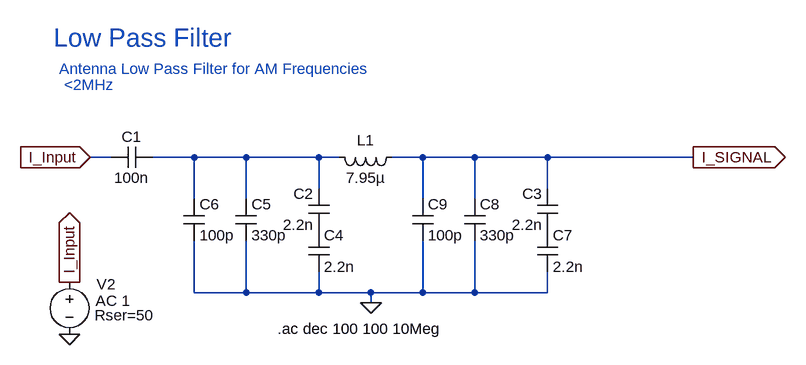
[diagram p0: schematic LP_filter.asc]
LP_filter.asc, the LTspice schematic file:
Version 4.1
SHEET 1 1076 680
WIRE -336 128 -368 128
WIRE -208 128 -272 128
WIRE -128 128 -208 128
WIRE -16 128 -128 128
WIRE 16 128 -16 128
WIRE 144 128 96 128
WIRE 224 128 144 128
WIRE 336 128 224 128
WIRE 560 128 336 128
WIRE -16 176 -16 128
WIRE 336 176 336 128
WIRE -208 192 -208 128
WIRE -128 192 -128 128
WIRE 144 192 144 128
WIRE 224 192 224 128
WIRE -208 336 -208 256
WIRE -128 336 -128 256
WIRE -128 336 -208 336
WIRE -16 336 -16 304
WIRE -16 336 -128 336
WIRE 64 336 -16 336
WIRE 144 336 144 256
WIRE 144 336 64 336
WIRE 224 336 224 256
WIRE 224 336 144 336
WIRE 336 336 336 304
WIRE 336 336 224 336
WIRE 64 352 64 336
FLAG -400 400 0
FLAG -400 320 I_Input
IOPIN -400 320 Out
FLAG -368 128 I_Input
IOPIN -368 128 In
FLAG 560 128 I_SIGNAL
IOPIN 560 128 Out
FLAG 64 352 0
SYMBOL voltage -400 304 R0
WINDOW 123 40 45 Left 2
WINDOW 39 39 67 Left 2
WINDOW 0 42 19 Left 2
SYMATTR Value2 AC 1
SYMATTR SpiceLine Rser=50
SYMATTR InstName V2
SYMATTR Value ""
SYMBOL cap -272 112 R90
WINDOW 0 0 32 VBottom 2
WINDOW 3 32 32 VTop 2
SYMATTR InstName C1
SYMATTR Value 100n
SYMBOL cap 0 240 R180
WINDOW 0 24 56 Left 2
WINDOW 3 24 8 Left 2
SYMATTR InstName C2
SYMATTR Value 2.2n
SYMBOL ind 112 112 R90
WINDOW 0 5 56 VBottom 2
WINDOW 3 32 56 VTop 2
SYMATTR InstName L1
SYMATTR Value 7.95µ
SYMBOL cap -32 240 R0
SYMATTR InstName C4
SYMATTR Value 2.2n
SYMBOL cap -144 192 R0
SYMATTR InstName C5
SYMATTR Value 330p
SYMBOL cap -224 192 R0
SYMATTR InstName C6
SYMATTR Value 100p
SYMBOL cap 352 240 R180
WINDOW 0 24 56 Left 2
WINDOW 3 24 8 Left 2
SYMATTR InstName C3
SYMATTR Value 2.2n
SYMBOL cap 320 240 R0
SYMATTR InstName C7
SYMATTR Value 2.2n
SYMBOL cap 208 192 R0
SYMATTR InstName C8
SYMATTR Value 330p
SYMBOL cap 128 192 R0
SYMATTR InstName C9
SYMATTR Value 100p
TEXT -80 392 Left 2 !.ac dec 100 100 10Meg
TEXT -424 -56 Left 4 ;Low Pass Filter
TEXT -416 -8 Left 2 ;Antenna Low Pass Filter for AM Frequencies
TEXT -408 16 Left 2 ;<2MHz

The netlist it stands for:
* LP_filter.asc
V2 I_Input 0 AC 1 Rser=50
C1 N001 I_Input 100n
C2 P001 N001 2.2n
L1 I_SIGNAL N001 7.95µ
C4 P001 0 2.2n
C5 N001 0 330p
C6 N001 0 100p
C3 P002 I_SIGNAL 2.2n
C7 P002 0 2.2n
C8 I_SIGNAL 0 330p
C9 I_SIGNAL 0 100p
.ac dec 100 100 10Meg
* Low Pass Filter
* Antenna Low Pass Filter for AM Frequencies
* <2MHz
.backanno
.end

* Results of the author's LTspice run, read from the files saved beside the schematic
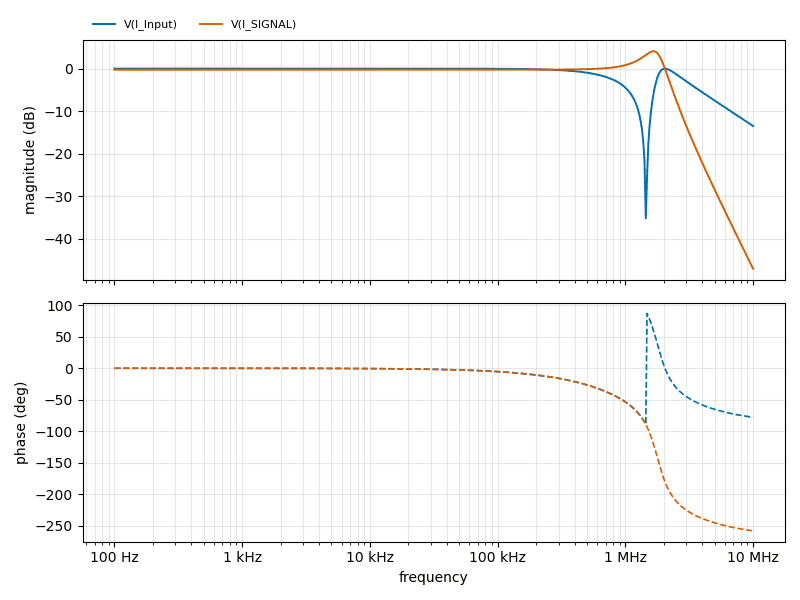
[diagram p1: AC Analysis of LP_filter.asc, plotted from the saved traces]
* AC Analysis, 1 run:
*   V(I_Input): -0.00 dB at 100 Hz, -13.52 dB at 10 MHz, peak -0.00 dB at 100 Hz, 3 dB below the peak at 852.3 kHz
*   V(I_SIGNAL): -0.26 dB at 100 Hz, -47.09 dB at 10 MHz, peak 4.09 dB at 1.66 MHz, 3 dB below the peak at 1.071 MHz and 1.976 MHz